# Altium schematic sheet _2__Power_Supply_Board.SchDoc (part 1 of 3)
size A4; DocumentNumber: 2; SheetNumber: 2; SheetTotal: 2
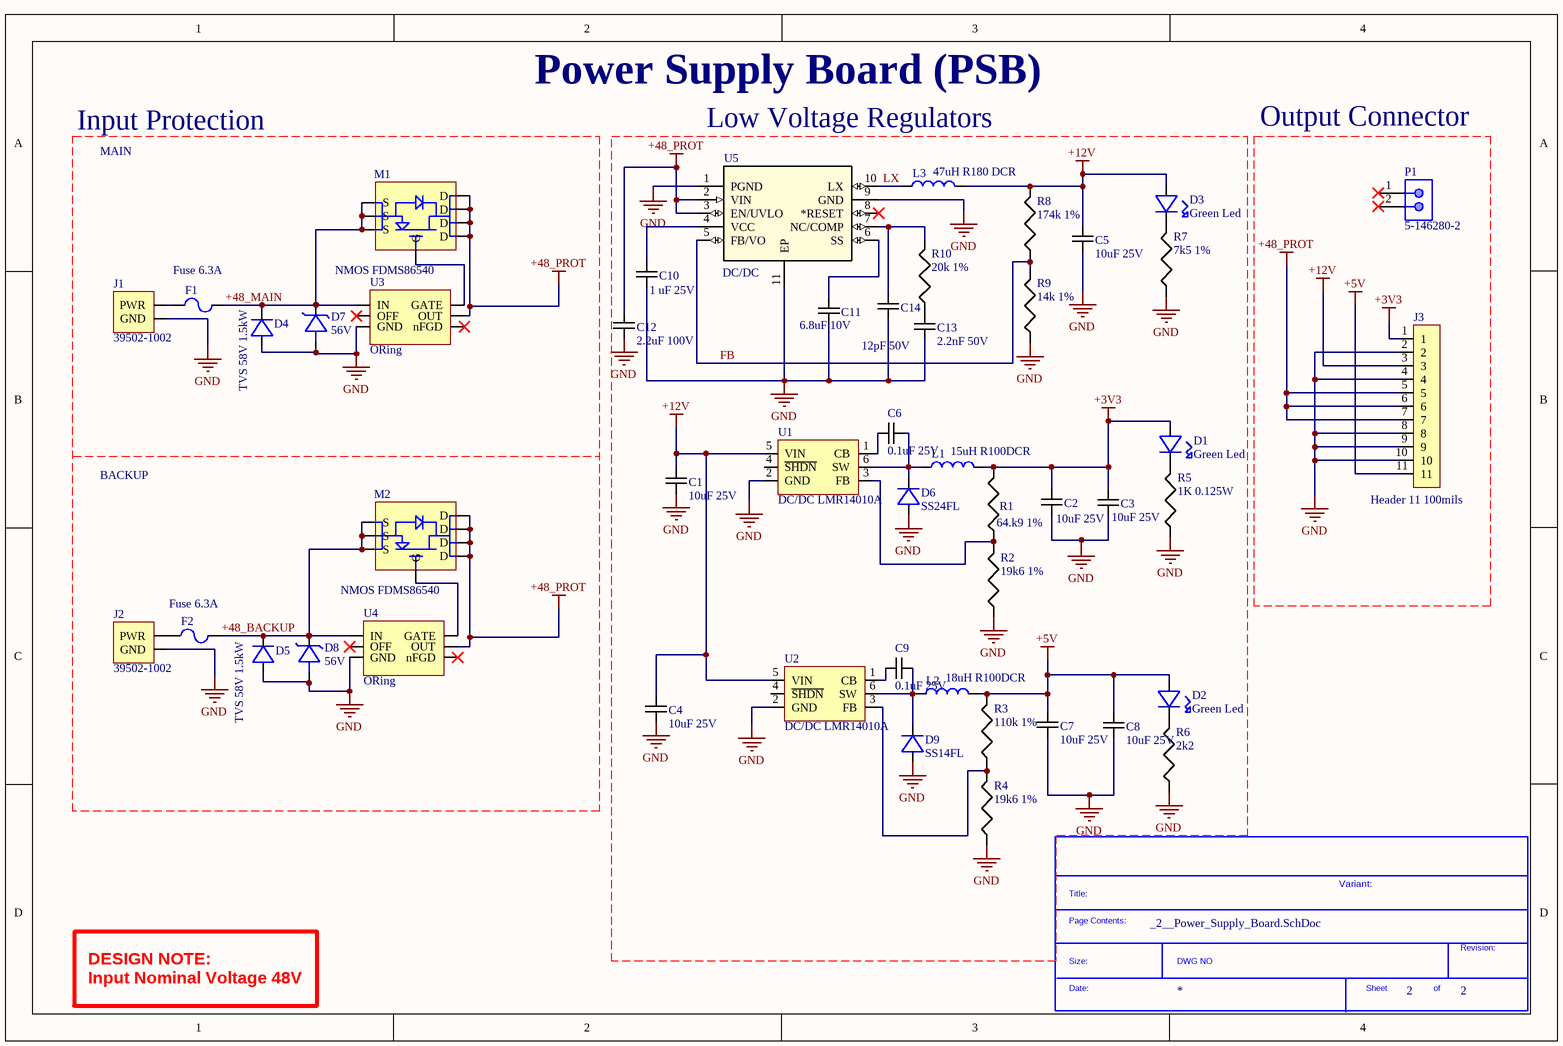
[diagram p0: _2__Power_Supply_Board.SchDoc]

## Parts
*?  SDTitleBlock  (value not drawn)  (graphical)
C1  10uF 25V  [C0805]
C2  10uF 25V  [C0805]
C3  10uF 25V  [C0805]
C4  10uF 25V  [C0805]
C5  10uF 25V  [C0805]
C6  0.1uF 25V  [C0805]
C7  10uF 25V  [C0805]
C8  10uF 25V  [C0805]
C9  0.1uF 25V  [C0805]
C10  1 uF 25V  [C0805]
C11  6.8uF 10V  [C0805]
C12  2.2uF 100V  [Capacitor 1206]
C13  2.2nF 50V  [C0805]
C14  12pF 50V  [C0805]
D1  Green Led  [Led Green 0805  Dialight 5988]
D2  Green Led  [Led Green 0805  Dialight 5988]
D3  Green Led  [Led Green 0805  Dialight 5988]
D4  TVS 58V 1.5kW  [TVS SMCJSeries]
D5  TVS 58V 1.5kW  [TVS SMCJSeries]
D6  SS24FL  [DIODE SS24FL SOD]
D7  56V  [DIODE ZENER 56V 1SMA5943BT3G]
D8  56V  [DIODE ZENER 56V 1SMA5943BT3G]
D9  SS14FL  [DIODE SS24FL SOD]
F1  Fuse 6.3A  [FUSE SMD 6.3A SF-2410FP630W]
F2  Fuse 6.3A  [FUSE SMD 6.3A SF-2410FP630W]
J1  39502-1002  [Terminal Block 0395021002]
J2  39502-1002  [Terminal Block 0395021002]
J3  Header 11 100mils  [Header 11 pos Male 2.54]
L1  15uH R100DCR  [Inductor SDE0805A-180M]
L2  18uH R100DCR  [Inductor SDE0805A-180M]
L3  47uH R180 DCR  [Inductor SDE0805A-180M]
M1  NMOS FDMS86540  [NMOS FDMS86540]
M2  NMOS FDMS86540  [NMOS FDMS86540]
P1  5-146280-2  [TECO-5-146280-2_V]
R1  64.k9 1%  [Resistor R0805 Panasonic ERJ]
R2  19k6 1%  [Resistor R0805 Panasonic ERJ]
R3  110k 1%  [Resistor R0805 Panasonic ERJ]
R4  19k6 1%  [Resistor R0805 Panasonic ERJ]
R5  1K 0.125W  [Resistor R0805 Panasonic ERJ]
R6  2k2  [Resistor R0805 Panasonic ERJ]
R7  7k5 1%  [Resistor R0805 Panasonic ERJ]
R8  174k 1%  [Resistor R0805 Panasonic ERJ]
R9  14k 1%  [Resistor R0805 Panasonic ERJ]
R10  20k 1%  [Resistor R0805 Panasonic ERJ]
U1  DC/DC LMR14010A  [LMR14010A]
U2  DC/DC LMR14010A  [LMR14010A]
U3  ORing  [LM5050]
U4  ORing  [LM5050]
U5  DC/DC  [DC/DC MAX17502]

## Nets
+3V3: C2.2 C3.2 D1.2 J3.1 L1.2 R1.2
+5V: C7.2 C8.2 D2.2 J3.11 L2.2 R3.2
+12V: C1.2 C4.2 C5.2 D3.2 J3.3 L3.2 R8.2 U1.5(VIN) U2.5(VIN)
+48_PROT: C12.2 J3.5 J3.6 J3.7 M1.5(D) M1.6(D) M1.7(D) M1.8(D) M2.5(D) M2.6(D) M2.7(D) M2.8(D) U3.6(OUT) U4.6(OUT) U5.2(VIN) U5.3(EN/UVLO)
GND: C1.1 C2.1 C3.1 C4.1 C5.1 C7.1 C8.1 C10.1 C11.1 C12.1 C13.1 C14.1 D4.2 D5.2 D6.2 D7.2 D8.2 D9.2 J1.2(GND) J2.2(GND) J3.2 J3.4 J3.8 J3.9 J3.10 R2.1 R4.1 R5.1 R6.1 R7.1 R9.1 U1.2(GND) U2.2(GND) U3.2(GND) U4.2(GND) U5.1(PGND) U5.9(GND) U5.11(EP)
+48_BACKUP: D5.1 D8.1 F2.2 M2.1(S) M2.2(S) M2.3(S) U4.4(IN)
+48_MAIN: D4.1 D7.1 F1.2 M1.1(S) M1.2(S) M1.3(S) U3.4(IN)
FB: R8.1 R9.2 U5.5(FB/VO)
LX: L3.1 U5.10(LX)
NetC6_1: C6.1 D6.1 L1.1 U1.6(SW)
NetC6_2: C6.2 U1.1(CB)
NetC9_1: C9.1 D9.1 L2.1 U2.6(SW)
NetC9_2: C9.2 U2.1(CB)
NetC10_2: C10.2 U5.4(VCC)
NetC11_2: C11.2 U5.6(SS)
NetC13_2: C13.2 R10.1
NetC14_2: C14.2 R10.2 U5.7(NC/COMP)
NetD1_1: D1.1 R5.2
NetD2_1: D2.1 R6.2
NetD3_1: D3.1 R7.2
NetF1_1: F1.1 J1.1(PWR)
NetF2_1: F2.1 J2.1(PWR)
NetM1_4: M1.4(G) U3.5(GATE)
NetM2_4: M2.4(G) U4.5(GATE)
NetR1_1: R1.1 R2.2 U1.3(FB)
NetR3_1: R3.1 R4.2 U2.3(FB)

Not connected (* = marked no-connect by the designer): P1 1* 2*; U1 4(~{SHDN}); U2 4(~{SHDN}); U3 1(nFGD)* 3(OFF)*; U4 1(nFGD)* 3(OFF)*; U5 8(*RESET)*

## Notes on the sheet
- Power Supply Board (PSB)
- Input Protection
- MAIN
- Low Voltage Regulators
- Output Connector
- BACKUP
- Variant:
- DESIGN NOTE:
  Input Nominal Voltage 48V
- Title
- Size:
- Date:
- A4
- Number:
- Time:
- Revision:
- Sheet
- of
- File:
- (in symbol SDTitleBlock) Title:; Page Contents:; Revision:; Size:; DWG NO; Date:; Sheet; of